# EAGLE design Rotator Control Teensy 26VAC v2 (EAGLE 9.6.2)
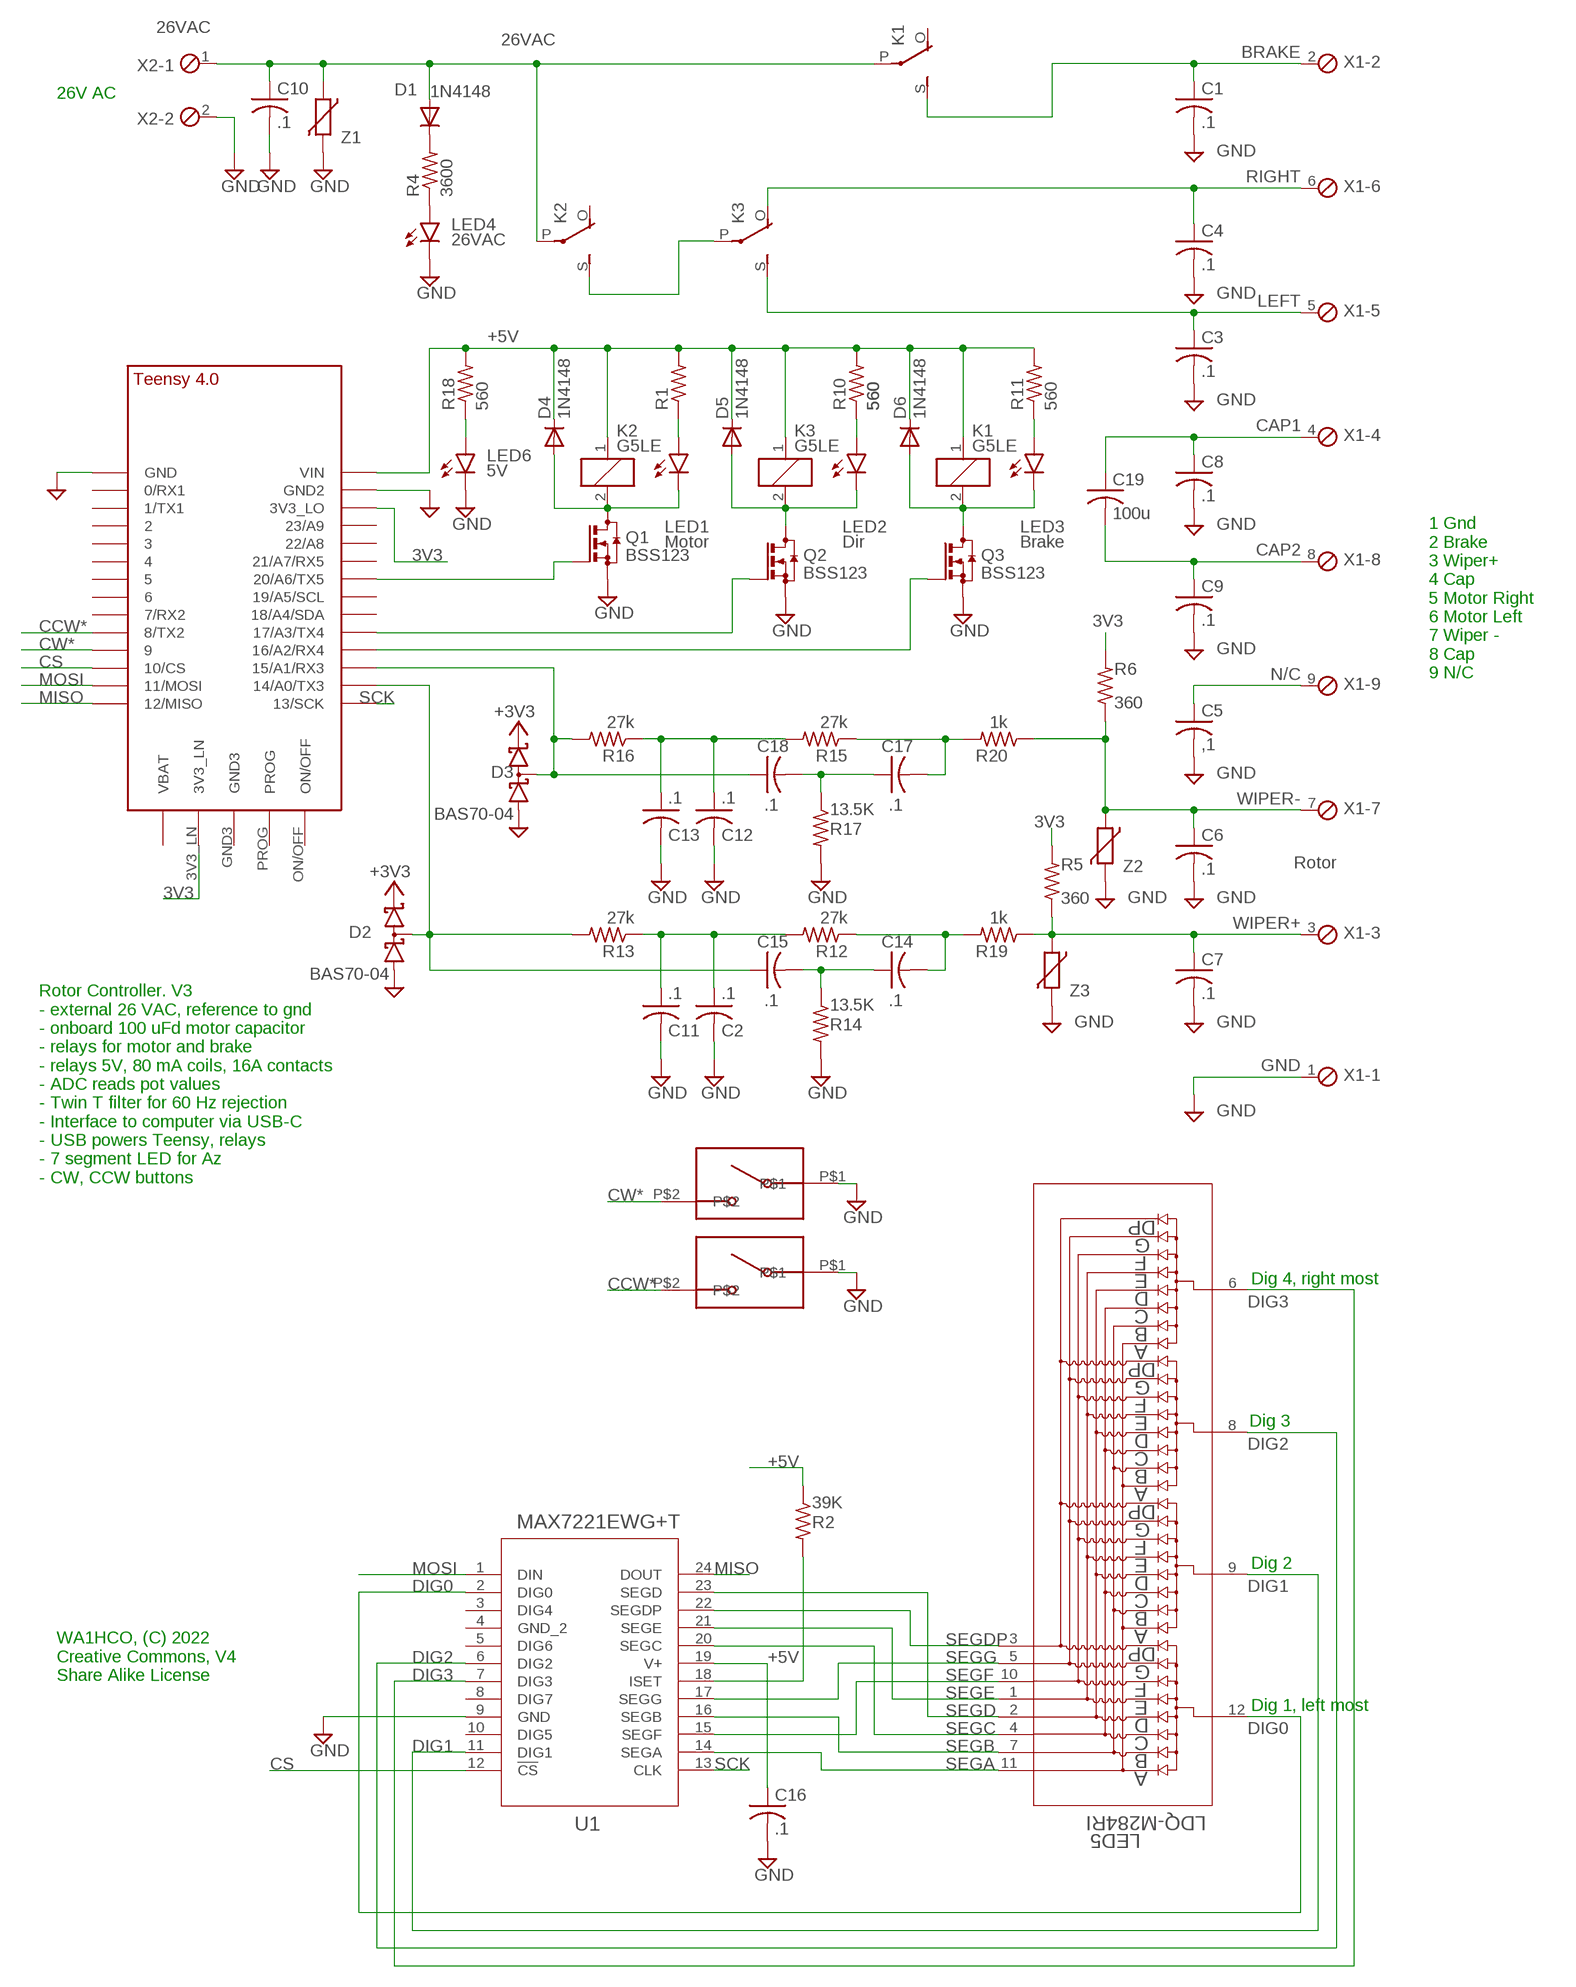
[diagram p0: schematic, sheet 1]

## Parts
C1  .1  C-USC1206  [C1206]
C2  .1  C-USC1206  [C1206]
C3  .1  C-USC1206  [C1206]
C4  .1  C-USC1206  [C1206]
C5  ,1  C-USC1206  [C1206]
C6  .1  C-USC1206  [C1206]
C7  .1  C-USC1206  [C1206]
C8  .1  C-USC1206  [C1206]
C9  .1  C-USC1206  [C1206]
C10  .1  C-USC1206  [C1206]
C11  .1  C-USC1206  [C1206]
C12  .1  C-USC1206  [C1206]
C13  .1  C-USC1206  [C1206]
C14  .1  C-USC1206  [C1206]
C15  .1  C-USC1206  [C1206]
C16  .1  C-USC1206  [C1206]
C17  .1  C-USC1206  [C1206]
C18  .1  C-USC1206  [C1206]
C19  100u  R60EW6100  [C4220]
CCW  SWITCH_AEXIT_6X6X9.5  [PUSHBUTTON_6X6]
CW  SWITCH_AEXIT_6X6X9.5  [PUSHBUTTON_6X6]
D1  1N4148  DIODESOD-123  [SOD-123]
D2  BAS70-04  [SOT23]
D3  BAS70-04  [SOT23]
D4  1N4148  DIODESOD-123  [SOD-123]
D5  1N4148  DIODESOD-123  [SOD-123]
D6  1N4148  DIODESOD-123  [SOD-123]
K1  G5LE  [G5LE]
K2  G5LE  [G5LE]
K3  G5LE  [G5LE]
LED1  Motor  LED3MM  [LED3MM]
LED2  Dir  LED3MM  [LED3MM]
LED3  Brake  LED3MM  [LED3MM]
LED4  26VAC  LED3MM  [LED3MM]
LED5  LDQ-M284RI  [LDQ-M284RI_LUM]
LED6  5V  LED3MM  [LED3MM]
Q1  BSS123  [SOT23]
Q2  BSS123  [SOT23]
Q3  BSS123  [SOT23]
R1  560  R-US_R0805  [R0805]
R2  39K  R-US_R0603  [R0603]
R4  3600  R-US_R0805  [R0805]
R5  360  R-US_R0805  [R0805]
R6  360  R-US_R0805  [R0805]
R10  560  R-US_R0805  [R0805]
R11  560  R-US_R0805  [R0805]
R12  27k  R-US_R0805  [R0805]
R13  27k  R-US_R0805  [R0805]
R14  13.5K  R-US_R0805  [R0805]
R15  27k  R-US_R0805  [R0805]
R16  27k  R-US_R0805  [R0805]
R17  13.5K  R-US_R0805  [R0805]
R18  560  R-US_R0805  [R0805]
R19  1k  R-US_R0805  [R0805]
R20  1k  R-US_R0805  [R0805]
U1  MAX7221EWG+T  [21-0042_W24+1_MXM]
U$1  TEENSY_4.0  [TEENSY_4.0]
X1  Rotor  MPT9  [9POL254]
X2  26VAC  MPT2  [2POL254]
Z1  VARISTORCN1206  [CT/CN1206]
Z2  VARISTORCN1206  [CT/CN1206]
Z3  VARISTORCN1206  [CT/CN1206]

## Nets
3V3: D2.2(C2) D3.2(C2) R5.2 R6.2 U$1.3V3_LN U$1.3V3_LO ; supply symbol labelled +3V3
26VAC: C10.1 D1.A K1.P(2:P) K2.P(2:P) X2.1 Z1.1
+5V: C16.1 D4.C D5.C D6.C K1.1 K2.1 K3.1 R1.2 R2.1 R10.2 R11.2 R18.2 U1.19(V+) U$1.VIN
BRAKE: C1.1 K1.S(2:S) X1.2
CAP1: C8.1 C19.P$1 X1.4
CAP2: C9.1 C19.P$2 X1.8
CCW*: CCW.P$2 U$1.8(8/TX2)
CS: U1.12(!CS) U$1.10/CS
CW*: CW.P$2 U$1.9/CS
DIG0: LED5.12 U1.2(DIG0)
DIG1: LED5.9 U1.11(DIG1)
DIG2: LED5.8 U1.6(DIG2)
DIG3: LED5.6 U1.7(DIG3)
GND: C1.2 C2.2 C3.2 C4.2 C5.2 C6.2 C7.2 C8.2 C9.2 C10.2 C11.2 C12.2 C13.2 C16.2 CCW.P$1 CW.P$1 D2.1(A1) D3.1(A1) LED4.K(C) LED6.K(C) Q1.2(S) Q2.2(S) Q3.2(S) R14.2 R17.2 U1.9(GND) U$1.GND U$1.GND2 X1.1 X2.2 Z1.2 Z2.2 Z3.2
ISET: R2.2 U1.18(ISET)
LEFT: C4.1 K3.O(2:O) X1.6
MISO: U1.24(DOUT) U$1.12/MISO
MOSI: U1.1(DIN) U$1.11/MOSI
N$1: C17.2 R15.1 R20.2
N$2: LED6.A R18.1
N$3: C14.2 R12.1 R19.2
N$4: LED1.A R1.1
N$5: LED2.A R10.1
N$6: LED3.A R11.1
N$7: C15.1 D2.3(C1A2) R13.2 U$1.14/A0(14/A0/TX3)
N$8: K2.S(2:S) K3.P(2:P)
N$9: D4.A K2.2 LED1.K(C) Q1.3(D)
N$10: D5.A K3.2 LED2.K(C) Q2.3(D)
N$11: D6.A K1.2 LED3.K(C) Q3.3(D)
N$12: Q3.1(G) U$1.16/A2(16/A2/RX4)
N$13: Q1.1(G) U$1.20/A6(20/A6/TX5)
N$14: Q2.1(G) U$1.17/A3(17/A3/TX4)
N$17: C2.1 C11.1 R12.2 R13.1
N$18: C14.1 C15.2 R14.1
N$21: C12.1 C13.1 R15.2 R16.1
N$22: C17.1 C18.2 R17.1
N$23: C18.1 D3.3(C1A2) R16.2 U$1.15/A1(15/A1/RX3)
N$24: D1.C R4.2
N$25: LED4.A R4.1
N/C: C5.1 X1.9
RIGHT: C3.1 K3.S(2:S) X1.5
SCK: U1.13(CLK) U$1.13/SCK
SEGA: LED5.11 U1.14(SEGA)
SEGB: LED5.7 U1.16(SEGB)
SEGC: LED5.4 U1.20(SEGC)
SEGD: LED5.2 U1.23(SEGD)
SEGDP: LED5.3 U1.22(SEGDP)
SEGE: LED5.1 U1.21(SEGE)
SEGF: LED5.10 U1.15(SEGF)
SEGG: LED5.5 U1.17(SEGG)
WIPER+: C7.1 R5.1 R19.1 X1.3 Z3.1
WIPER-: C6.1 R6.1 R20.1 X1.7 Z2.1
Unconnected: K1.O(2:O) K2.O(2:O) U1.3(DIG4) U1.4(GND_2) U1.5(DIG6) U1.8(DIG7) U1.10(DIG5) U$1.0/RX(0/RX1) U$1.1/TX(1/TX1) U$1.2 U$1.3/CANTX U$1.4/CANRX U$1.5 U$1.6 U$1.7(7/RX2) U$1.18/A4/SDA U$1.19/A5/SCL U$1.21/A7(21/A7/RX5) U$1.22/A8 U$1.23/A9 U$1.GND3 U$1.ON/OFF U$1.PROG U$1.VBAT\(VBAT)

## Notes on the sheet
- 26V AC
- 1 Gnd
  2 Brake
  3 Wiper+
  4 Cap
  5 Motor Right
  6 Motor Left
  7 Wiper -
  8 Cap
  9 N/C
- Rotor Controller. V3
  - external 26 VAC, reference to gnd
  - onboard 100 uFd motor capacitor
  - relays for motor and brake
  - relays 5V, 80 mA coils, 16A contacts
  - ADC reads pot values
  - Twin T filter for 60 Hz rejection
  - Interface to computer via USB-C
  - USB powers Teensy, relays
  - 7 segment LED for Az
  - CW, CCW buttons
- Dig 4, right most
- Dig 3
- Dig 2
- WA1HCO, (C) 2022
  Creative Commons, V4
  Share Alike License
- Dig 1, left most

## Library data of the parts
C1-C18 = rcl:C-US: CAPACITOR, American symbol; SPICEPREFIX: C
C19 = my-library:R60EW6100
CCW CW = my-library:SWITCH_AEXIT_6X6X9.5
D1 D4-D6 = adafruit:DIODE: Diode SMADIODE - SMA Surface Mount Package 20V 1A Schottky Diode Digikey: 641-1014-6-ND DO-1N4148 - Through Hole Small Current Diode SOD-123 20V 1 A (.5mV Vf) Schottky Diode - Digikey: MBRX120TPMSCT-ND SOD-323 10V 570mA (.38mV Vf, 3ns) Schottky Diode - Digikey: ZLLS410CT-ND SOD-523 30V 30mA Schottky Diode (RB751S-40TE61) - Digikey: RB751S-40TE61CT-ND SOT23-R/W - SOT23 Package (R = Solder Paste/Reflow Ovens, W = Hand-Soldering) BAT54Film 40V 300mA - Digikey: 497-7162-1-ND
D2 D3 = diode:BAS70-04: Silicon Schottky Diodes General-purpose diode for high-speed switching
K1-K3 = relay:G5LE: RELAY 1 x switch, 10 A/120 V AC, 8 A/30 V DC, Omron; OC_FARNELL: unknown; OC_NEWARK: unknown
LED1-LED4 LED6 = led:LED: LED OSRAM: - CHIPLED LG R971, LG N971, LY N971, LG Q971, LY Q971, LO R971, LY R971 LH N974, LH R974 LS Q976, LO Q976, LY Q976 LO Q996 - Hyper CHIPLED LW Q18S LB Q993, LB Q99A, LB R99A - SideLED LS A670, LO A670, LY A670, LG A670, LP A670 LB A673, LV A673, LT A673, LW A673 LH A674 LY A675 LS A676, LA A676, LO A676, LY A676, LW A676 LS A679, LY A679, LG A679 - Hyper Micro SIDELED® LS Y876, LA Y876, LO Y876, LY Y876 LT Y87S - SmartLED LW L88C, LW L88S LB L89C, LB L89S, LG L890 LS L89K, LO L89K, LY L89K LS L896, LA L896, LO L896, LY L896 - TOPLED LS T670, LO T670, LY T670, LG T670, LP T670 LSG T670, LSP T670, LSY T670, LOP T670, LYG T670 LG T671, LOG T671, LSG T671 LB T673, LV T673, LT T673, LW T673 LH T674 LS T676, LA T676, LO T676, LY T676, LB T676, LH T676, LSB T676, LW T676 LB T67C, LV T67C, LT T67C, LS T67K, LO T67K, LY T67K, LW E67C LS E67B, LA E67B, LO E67B, LY E67B, LB E67C, LV E67C, LT E67C LW T67C LS T679, LY T679, LG T679 LS T770, LO T770, LY T770, LG T770, LP T770 LB T773, LV T773, LT T773, LW T773 LH T774 LS E675, LA E675, LY E675, LS T675 LS T776, LA T776, LO T776, LY T776, LB T776 LHGB T686 LT T68C, LB T68C - Hyper Mini TOPLED® LB M676 - Mini TOPLED Santana® LG M470 LS M47K, LO M47K, LY M47K Source: http://www.osram.convergy.de LUXEON: - LUMILED® LXK2-PW12-R00, LXK2-PW12-S00, LXK2-PW14-U00, LXK2-PW14-V00 LXK2-PM12-R00, LXK2-PM12-S00, LXK2-PM14-U00 LXK2-PE12-Q00, LXK2-PE12-R00, LXK2-PE12-S00, LXK2-PE14-T00, LXK2-PE14-U00 LXK2-PB12-K00, LXK2-PB12-L00, LXK2-PB12-M00, LXK2-PB14-N00, LXK2-PB14-P00, LXK2-PB14-Q00 LXK2-PR12-L00, LXK2-PR12-M00, LXK2-PR14-Q00, LXK2-PR14-R00 LXK2-PD12-Q00, LXK2-PD12-R00, LXK2-PD12-S00 LXK2-PH12-R00, LXK2-PH12-S00 LXK2-PL12-P00, LXK2-PL12-Q00, LXK2-PL12-R00 Source: www.luxeon.com KINGBRIGHT: KA-3528ASYC Source: www.kingbright.com
LED5 = my-library:LDQ-M284RI; COPYRIGHT: Copyright (C) 2022 Ultra Librarian. All rights reserved.; DIGI-KEY_PART_NUMBER_1: 67-1427-ND; MANUFACTURER_PART_NUMBER: LDQ-M284RI; MFR_NAME: Lumex
Q1-Q3 = transistor-small-signal:BSS123: N-CHANNEL MOS FET
R1 R2 R4-R6 R10-R20 = rcl:R-US_: RESISTOR, American symbol; SPICEPREFIX: R
U1 = MAX7219:MAX7221EWG+T; COPYRIGHT: Copyright (C) 2022 Ultra Librarian. All rights reserved.; DIGI-KEY_PART_NUMBER_1: MAX7219EWG+T-ND; DIGI-KEY_PART_NUMBER_2: MAX7219EWG+TCT-ND; DIGI-KEY_PART_NUMBER_3: MAX7219EWG+TDKR-ND; DIGI-KEY_PART_NUMBER_4: MAX7219EWG+TTR-ND; MANUFACTURER_PART_NUMBER: MAX7219EWG+T; MFR_NAME: Maxim Integrated Products
U$1 = TEENSY 4.0:TEENSY_4.0
X1 = con-phoenix-254:MPT9: PHOENIX CONNECTOR; OC_FARNELL: unknown; OC_NEWARK: unknown
X2 = con-phoenix-254:MPT2: PHOENIX CONNECTOR; OC_FARNELL: unknown; OC_NEWARK: unknown
Z1-Z3 = varistor:VARISTOR: VARISTOR

## Board
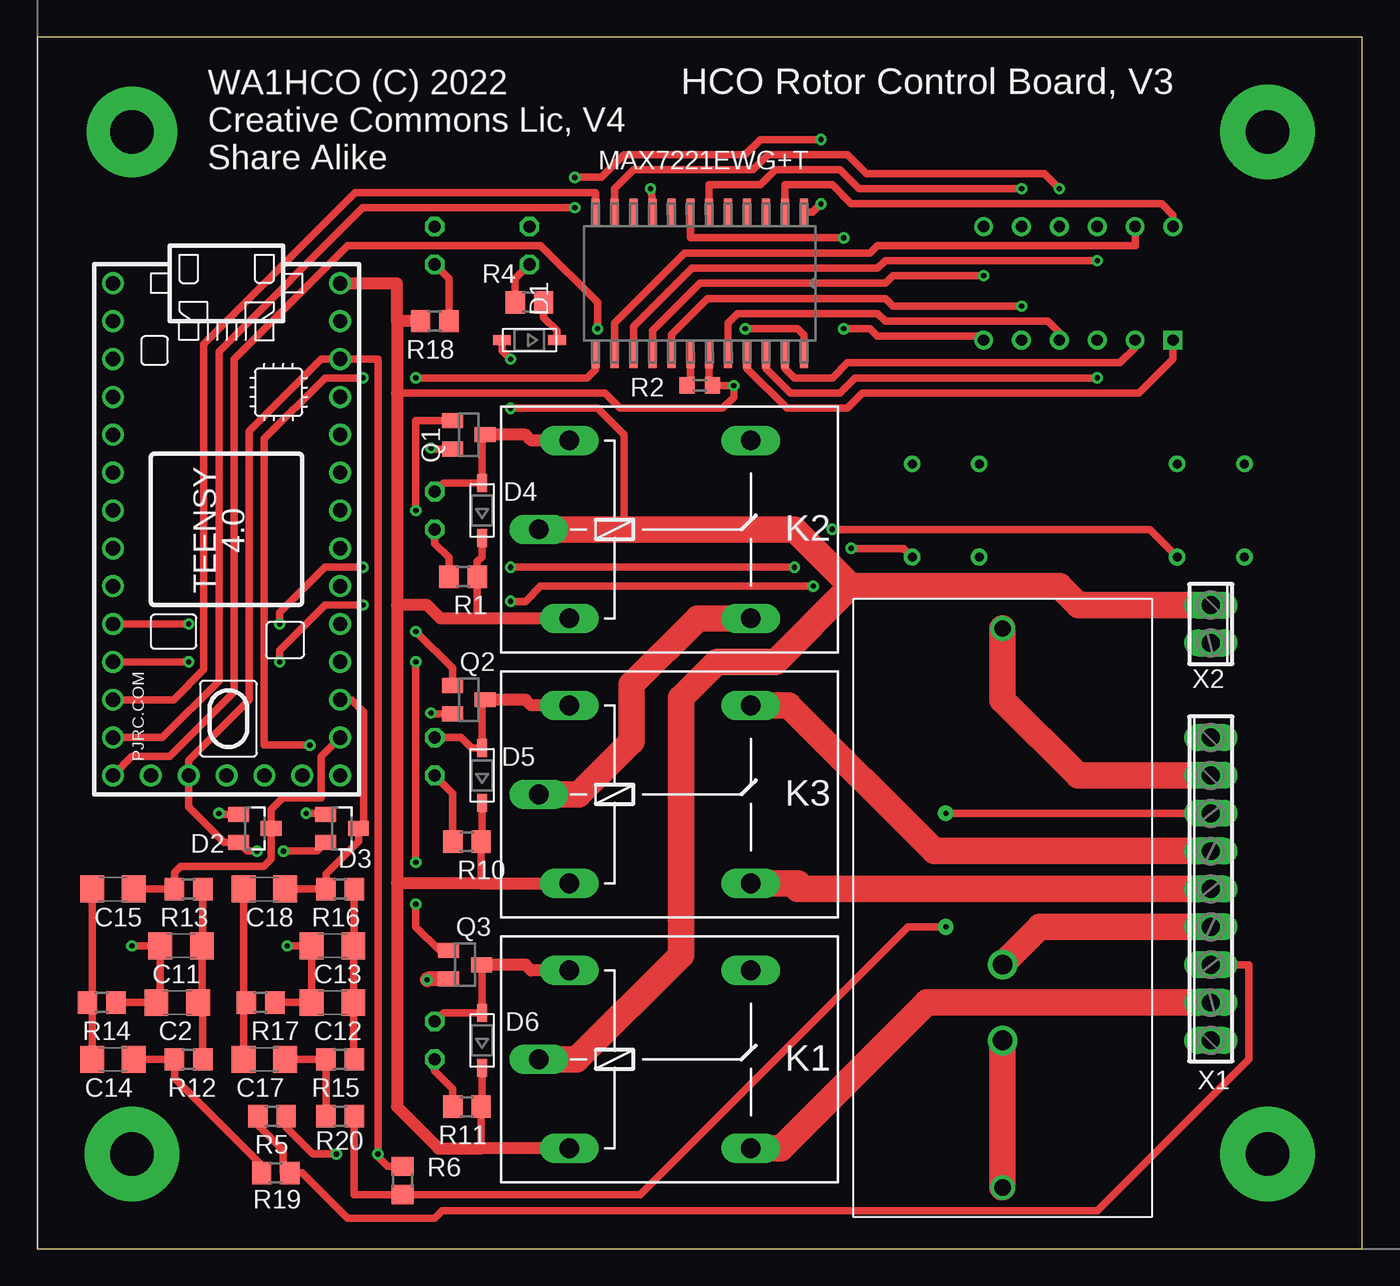
[diagram p1: board, top side]
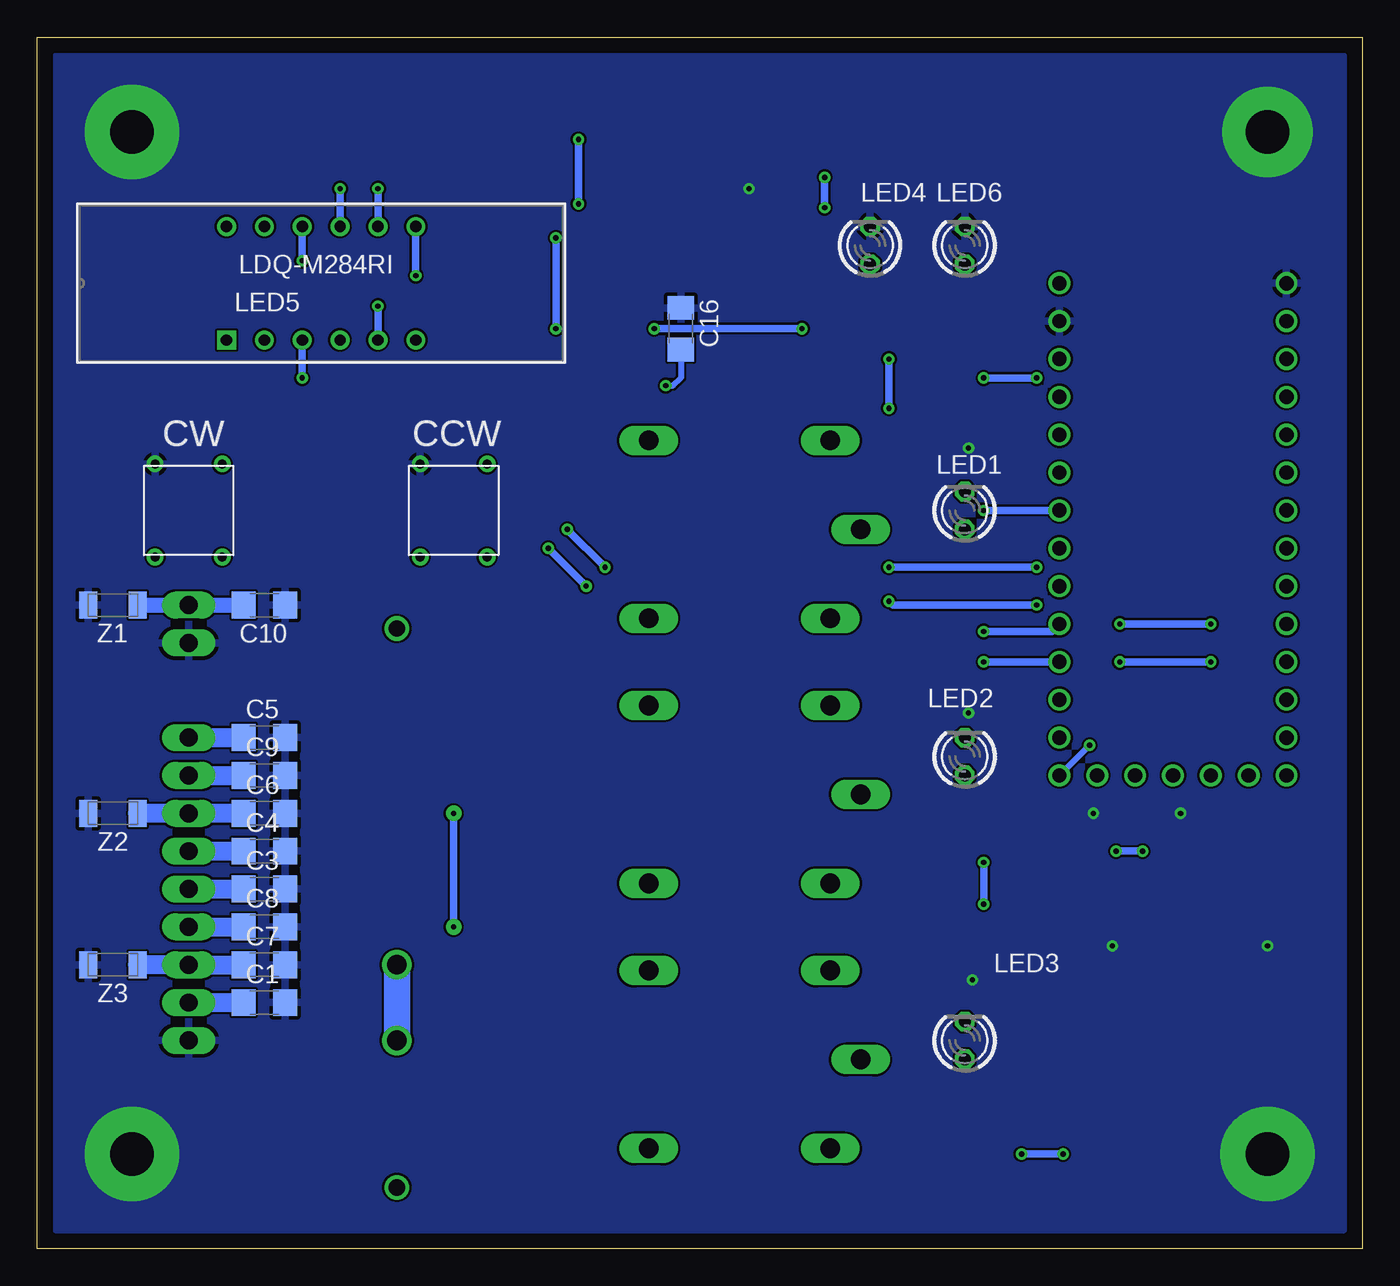
[diagram p2: board, bottom side, seen from below]

Size 88.9 x 81.28 mm. Coordinates in mm from the lower left corner, seen from the top.
Outline: 0,0 88.9,0 88.9,81.28 0,81.28 0,0
Copper layers (1*16): Top 0.035mm / dielectric 1.5mm / Bottom 0.035mm
Design rules "default": minimum track width 6mil, minimum drill 0.35mm, track to track 6mil, track to pad 6mil, pad to pad 6mil, via to via 6mil, smd to smd 6mil, copper to edge 40mil, drill to drill 6mil, minimum pad ring 10mil, minimum via ring 8mil, stop-mask expansion 4mil, vias tented up to drill 0mil, thermal gap 10mil

### Footprints (pad centres in the part's own frame; a part is rotated, then mirrored left to right if it is on the bottom)
C1206 = smd 1.6 x 1.8: 1 -1.4,0; 2 1.4,0
C4220 = drill 1.1: P$1 -18.75,0; P$2 18.75,0
PUSHBUTTON_6X6 = drill 0.6: P$1 -2.25,3.125; P$2 2.25,-3.125; P$3 -2.25,-3.125; P$4 2.25,3.125
SOD-123 = smd 1.2 x 0.7: A 1.85,0; C -1.85,0
SOT23 = smd 1 x 1.4: 1 -0.95,-1.1; 2 0.95,-1.1; 3 0,1.1
G5LE = drill 1.321 long: 1 -7.493,-5.969; 2 -7.493,5.969; O 4.699,5.969; P -9.525,0; S 4.699,-5.969
LED3MM = drill 0.813 octagon: A -1.27,0; K 1.27,0
LDQ-M284RI_LUM = drill 0.762 pad 1.27 square: 1 0,0 | drill 0.762 pad 1.27: 2 0,-2.54; 3 0,-5.08; 4 0,-7.62; 5 0,-10.16; 6 0,-12.7; 7 7.62,-12.7; 8 7.62,-10.16; 9 7.62,-7.62; 10 7.62,-5.08; 11 7.62,-2.54; 12 7.62,0
R0805 = smd 1.3 x 1.5: 1 -0.95,0; 2 0.95,0
R0603 = smd 1 x 1.1: 1 -0.85,0; 2 0.85,0
21-0042_W24+1_MXM = smd 1.845 x 0.533: 1 -4.758,6.985; 2 -4.758,5.715; 3 -4.758,4.445; 4 -4.758,3.175; 5 -4.758,1.905; 6 -4.758,0.635; 7 -4.758,-0.635; 8 -4.758,-1.905; 9 -4.758,-3.175; 10 -4.758,-4.445; 11 -4.758,-5.715; 12 -4.758,-6.985; 13 4.758,-6.985; 14 4.758,-5.715; 15 4.758,-4.445; 16 4.758,-3.175; 17 4.758,-1.905; 18 4.758,-0.635; 19 4.758,0.635; 20 4.758,1.905; 21 4.758,3.175; 22 4.758,4.445; 23 4.758,5.715; 24 4.758,6.985
TEENSY_4.0 = drill 0.965: 0/RX -13.97,-7.62; 1/TX -11.43,-7.62; 2 -8.89,-7.62; 3/CANTX -6.35,-7.62; 3V3_LN 16.51,-2.54; 3V3_LO -11.43,7.62; 4/CANRX -3.81,-7.62; 5 -1.27,-7.62; 6 1.27,-7.62; 7 3.81,-7.62; 8 6.35,-7.62; 9/CS 8.89,-7.62; 10/CS 11.43,-7.62; 11/MOSI 13.97,-7.62; 12/MISO 16.51,-7.62; 13/SCK 16.51,7.62; 14/A0 13.97,7.62; 15/A1 11.43,7.62; 16/A2 8.89,7.62; 17/A3 6.35,7.62; 18/A4/SDA 3.81,7.62; 19/A5/SCL 1.27,7.62; 20/A6 -1.27,7.62; 21/A7 -3.81,7.62; 22/A8 -6.35,7.62; 23/A9 -8.89,7.62; GND -16.51,-7.62; GND2 -13.97,7.62; GND3 16.51,0; ON/OFF 16.51,5.08; PROG 16.51,2.54; VBAT\ 16.51,-5.08; VIN -16.51,7.62
9POL254 = drill 1.2 long: 1 -10.16,0; 2 -7.62,0; 3 -5.08,0; 4 -2.54,0; 5 0,0; 6 2.54,0; 7 5.08,0; 8 7.62,0; 9 10.16,0
2POL254 = drill 1.2 long: 1 -1.27,0; 2 1.27,0
CT/CN1206 = smd 1.2 x 1.8: 1 -1.65,0; 2 1.65,0

### Placement (x,y rotation side)
C1  73.66,16.51 0 bottom
C2  9.4,16.51 180 top
C3  73.66,24.13 0 bottom
C4  73.66,26.67 0 bottom
C5  73.66,34.29 0 bottom
C6  73.66,29.21 0 bottom
C7  73.66,19.05 0 bottom
C8  73.66,21.59 0 bottom
C9  73.66,31.75 0 bottom
C10  73.66,43.18 0 bottom
C11  9.65,20.32 180 top
C12  19.81,16.51 180 top
C13  19.81,20.32 180 top
C14  5.08,12.7 0 top
C15  5.08,24.13 180 top
C16  45.72,61.72 90 bottom
C17  15.24,12.7 0 top
C18  15.24,24.13 180 top
C19  64.77,22.86 90 top
CCW  78.74,49.53 0 bottom
CW  60.96,49.53 0 bottom
D1  33.02,60.96 180 top
D2  14.61,28.19 270 top
D3  20.45,28.19 270 top
D4  29.84,49.53 90 top
D5  29.84,31.75 90 top
D6  29.84,13.97 90 top
K1  43.18,12.7 0 top
K2  43.18,48.26 0 top
K3  43.18,30.48 0 top
LED1  26.67,49.53 90 bottom
LED2  26.67,33.02 90 bottom
LED3  26.67,13.97 90 bottom
LED4  33.02,67.31 90 bottom
LED5  76.2,60.96 90 bottom
LED6  26.67,67.31 90 bottom
Q1  28.96,54.61 270 top
Q2  28.96,36.83 270 top
Q3  28.7,19.05 270 top
R1  28.57,45.09 0 top
R2  44.45,57.91 180 top
R4  33.02,63.5 0 top
R5  15.75,8.89 0 top
R6  24.51,4.57 90 top
R10  28.83,27.3 0 top
R11  28.83,9.53 0 top
R12  10.16,12.7 0 top
R13  10.16,24.13 180 top
R14  4.32,16.51 0 top
R15  20.32,12.7 0 top
R16  20.32,24.13 180 top
R17  14.99,16.51 0 top
R18  26.67,62.23 180 top
R19  16,5.08 180 top
R20  20.32,8.89 180 top
U1  44.45,64.77 270 top
U$1  12.7,48.26 270 top
X1  78.74,24.13 90 top
X2  78.74,41.91 270 top
Z1  83.82,43.18 180 bottom
Z2  83.82,29.21 180 bottom
Z3  83.82,19.05 180 bottom

### Tracks (layer width: path | path; a pad name or v marks a point on that pad's centre or on a via)
3V3  (via drill 0.35)
  Top 0.508: R6.2 23.5,5.52 22.86,6.16 v22.86,6.35 22.86,59.69 U$1.3V3_LO 19.05,59.69 14.22,54.86 14.22,36.83 10.16,32.77 U$1.3V3_LN 10.16,29.62 12.54,27.24 D2.2 14.08,26.67 v14.73,26.67 | R5.2 16.7,8.13 18.48,6.35 v20.07,6.35 | D3.2 18.77,26.67 v16.51,26.67
  Bottom 0.508: v22.86,6.35 v20.07,6.35 | v16.51,26.67 v14.73,26.67
26VAC  (via drill 0.35)
  Top 0.508: 39.37,48.26 39.37,54.61 37.59,56.39 34.98,56.39 v31.75,56.39 | D1.A 31.17,60.27 v31.75,59.69
  Top 1.778: K1.P 36.2,12.7 43.18,19.68 43.18,36.96 45.59,39.37 49.53,39.37 54.61,44.45 | 54.61,44.45 50.8,48.26 39.37,48.26 K2.P | X2.1 69.85,43.18 68.58,44.45 54.61,44.45
  Bottom 0.508: v31.75,59.69 v31.75,56.39
  Bottom 1.016: C10.1 X2.1 Z1.1
+5V  (via drill 0.35)
  Top 0.508: 29.52,42.29 R1.2 29.52,46.09 29.84,46.41 D4.C | 29.78,6.73 R11.2 29.84,9.53 D6.C | D5.C 29.84,27.37 R10.2 29.78,24.51 | U1.19 45.09,57.91 R2.1 v46.74,57.91 46.74,57.15 45.97,56.39 39.12,56.39 38.1,57.4 24.13,57.4
  Top 0.813: K2.1 29.52,42.29 27.05,42.29 26.16,43.18 24.13,43.18 | K1.1 29.78,6.73 26.92,6.73 24.13,9.53 24.13,24.51 | U$1.VIN 24.13,64.77 24.13,62.23 | R18.2 24.13,62.23 | 24.13,62.23 24.13,57.4 24.13,43.18 | 24.13,43.18 24.13,24.51 | 24.13,24.51 29.78,24.51 K3.1
  Bottom 0.406: C16.1 45.72,58.42 46.23,57.91 v46.74,57.91
BRAKE
  Top 1.778: X1.2 59.69,16.51 49.91,6.73 K1.S
  Bottom 1.27: X1.2 C1.1
CAP1  (via drill 1.32)
  Top 1.778: X1.4 67.28,21.59 64.77,19.07 v64.77,19.05 | C19.P$1 v64.77,13.97
  Bottom 1.27: X1.4 C8.1
  Bottom 1.778: v64.77,19.05 v64.77,13.97
CAP2
  Top 1.778: X1.8 69.85,31.75 64.77,36.83 C19.P$2
  Bottom 1.27: X1.8 C9.1
CCW*  (via drill 0.35)
  Top 0.508: CCW.P$2 74.64,48.26 v53.34,48.26 | v50.8,45.72 v31.75,45.72 | v16.26,41.91 16.26,42.67 19.3,45.72 v21.84,45.72 | U$1.8 v10.16,41.91
  Bottom 0.508: v53.34,48.26 v50.8,45.72 | v31.75,45.72 v21.84,45.72 | v10.16,41.91 v16.26,41.91
CS
  Top 0.508: U1.12 37.47,70.87 21.34,70.87 11.18,60.71 11.18,38.86 9.14,36.83 U$1.10/CS
CW*  (via drill 0.35)
  Top 0.508: CW.P$2 58.12,46.99 v54.61,46.99 | v52.07,44.45 33.78,44.45 32.77,43.43 v31.75,43.43 | v16.26,39.37 16.26,40.13 19.3,43.18 v21.84,43.18 | U$1.9/CS v10.16,39.37
  Bottom 0.508: v54.61,46.99 v52.07,44.45 | v31.75,43.43 31.5,43.18 v21.84,43.18 | v10.16,39.37 v16.26,39.37
DIG0
  Top 0.508: U1.2 50.16,71.37 53.34,71.37 54.61,70.1 75.44,70.1 76.2,69.34 LED5.12
DIG1  (via drill 0.35)
  Top 0.508: U1.11 38.73,71.12 40.01,72.39 48.01,72.39 49.02,73.41 54.36,73.41 55.63,72.14 67.56,72.14 v68.58,71.12
  Bottom 0.508: v68.58,71.12 LED5.9
DIG2  (via drill 0.35)
  Top 0.508: U1.6 45.09,71.37 48.51,71.37 49.53,72.39 53.85,72.39 55.12,71.12 v66.04,71.12
  Bottom 0.508: v66.04,71.12 LED5.8
DIG3  (via drill 0.35)
  Top 0.508: U1.7 43.81,67.82 v54.1,67.82 | LED5.6 63.25,61.21 56.39,61.21 55.88,61.72 v54.1,61.72
  Bottom 0.508: v54.1,67.82 v54.1,61.72
GND  (via drill 0.35, 2.92 pad 6.1, 2.92 pad 6.35)
  Top 0.406: 41.23,71.04 v41.15,71.12
  Top 0.508: Q1.2 26.48,53.66 v26.42,53.72 | Q2.2 26.42,35.88 v26.42,35.94 | v6.35,20.32 C11.2 8.25,16.51 C2.2 R14.2 | v16.76,20.32 C13.2 C12.2 R17.2 | 41.23,71.04 U1.9 | D2.1 12.26,29.14 v12.19,29.21 | D3.1 19.28,29.21 v18.03,29.21
  Top 1.016: Q3.2 26.23,18.1 v26.16,18.03
  other vias: 6.35,6.35 82.55,6.35 82.55,74.93 6.35,74.93
  pour Bottom: 1.27,80.01 87.63,80.01 87.63,1.27 1.27,1.27
ISET
  Top 0.406: 43.81,58.13 R2.2
  Top 0.508: U1.18 43.81,58.13
LEFT
  Top 1.778: K3.O 50.42,36.45 60.2,26.67 61.21,26.67 X1.6
  Bottom 1.27: X1.6 C4.1
MISO  (via drill 0.35)
  Top 0.508: v37.59,61.72 37.59,63.5 33.78,67.31 20.83,67.31 13.21,59.69 13.21,37.34 8.89,33.02 6.35,33.02 U$1.12/MISO | U1.24 51.44,61.28 50.99,61.72 v47.5,61.72
  Bottom 0.508: v47.5,61.72 44.45,61.72 v37.59,61.72
MOSI  (via drill 0.35)
  Top 0.508: v36.07,71.88 37.85,71.88 39.37,73.41 47.5,73.41 48.51,74.42 v52.58,74.42 | v36.07,69.85 21.84,69.85 12.19,60.2 12.19,38.1 8.38,34.29 U$1.11/MOSI | v52.58,70.1 52,69.53 U1.1
  Bottom 0.508: v52.58,74.42 v52.58,70.1 | v36.07,71.88 v36.07,69.85
N$1
  Top 0.508: C17.2 R15.1 R20.2
N$2
  Top 0.508: R18.1 27.62,65.09 LED6.A
N$3
  Top 0.508: C14.2 R12.1 9.21,11.43 15.05,5.59 R19.2
N$4
  Top 0.508: R1.1 27.62,46.35 26.67,47.31 LED1.A
N$5
  Top 0.508: LED2.A 27.88,30.54 R10.1
N$6
  Top 0.508: R11.1 27.88,10.73 26.67,11.94 LED3.A
N$7
  Top 0.508: U$1.14/A0 19.05,33.02 19.05,30.23 16.47,30.23 15.71,29.46 D2.3 15.71,26.16 15.2,25.65 9.61,25.65 9.21,25.25 R13.2 C15.1
N$8
  Top 1.778: K2.S 44.32,42.29 39.88,37.85 39.88,34.04 36.32,30.48 K3.P
N$9
  Top 0.508: Q1.3 29.97,54.61 29.84,54.49 D4.A 27.25,51.38 LED1.K
  Top 0.813: K2.2 33.15,54.23 32.77,54.61 Q1.3
N$10
  Top 0.508: Q2.3 29.84,36.62 D5.A 29.14,33.6 28.45,34.29 LED2.K
  Top 0.813: K3.2 33.15,36.45 32.77,36.83 Q2.3
N$11
  Top 0.508: Q3.3 29.84,19.01 D6.A 27.25,15.82 LED3.K
  Top 0.813: K1.2 33.15,18.67 32.77,19.05 Q3.3
N$12  (via drill 0.35)
  Top 0.508: Q3.1 26.99,20 25.4,21.59 v25.4,23.11 | v25.4,39.37 v25.4,25.91
  Bottom 0.508: U$1.16/A2 v25.4,39.37 | v25.4,25.91 v25.4,23.11
N$13  (via drill 0.35)
  Top 0.508: Q1.1 25.4,55.56 v25.4,49.53
  Bottom 0.508: U$1.20/A6 v25.4,49.53
N$14  (via drill 0.35)
  Top 0.508: Q2.1 27.86,38.95 v25.4,41.4
  Bottom 0.508: v25.4,41.4 20.83,41.4 U$1.17/A3
N$17
  Top 0.508: R12.2 11.11,16.2 C2.1 11.05,16.51 C11.1 11.11,20.32 R13.1
N$18
  Top 0.508: C15.2 3.68,16.51 | R14.1 3.68,16.51 | C14.1 3.68,16.51
N$21
  Top 0.508: R16.1 21.27,20.32 C13.1 C12.1 21.21,12.76 R15.2
N$22
  Top 0.508: C17.1 13.84,16.31 R17.1 13.84,16.71 C18.2
N$23
  Top 0.508: C18.1 R16.2 19.37,25.15 21.55,27.32 D3.3 21.91,28.19 | U$1.15/A1 21.08,36.83 21.91,36 21.91,28.19 | 21.91,28.19
N$24
  Top 0.508: R4.2 33.97,62.48 34.87,61.58 D1.C
N$25
  Top 0.508: R4.1 32.07,65.09 LED4.A
N/C
  Bottom 1.27: X1.9 C5.1
RIGHT
  Top 1.778: K3.S 51.05,24.51 51.05,24.13 X1.5
  Bottom 1.27: X1.5 C3.1
SCK  (via drill 0.35)
  Top 0.508: v18.29,33.78 15.24,33.78 15.24,54.36 19.3,58.42 v21.84,58.42 | U1.13 37.47,59 36.89,58.42 v25.4,58.42
  Bottom 0.406: U$1.13/SCK v18.29,33.78
  Bottom 0.508: v21.84,58.42 v25.4,58.42
SEGA
  Top 0.508: U1.14 38.73,62.1 43.43,66.8 55.88,66.8 56.39,67.31 73.66,67.31 LED5.11
SEGB  (via drill 0.35)
  Top 0.508: U1.16 41.27,61.59 44.45,64.77 56.9,64.77 57.4,65.28 v63.5,65.28
  Bottom 0.508: v63.5,65.28 LED5.7
SEGC
  Top 0.508: U1.20 46.35,62.1 46.99,62.74 56.39,62.74 56.9,62.23 67.82,62.23 68.58,61.47 LED5.4
SEGD
  Top 0.508: LED5.2 73.66,60.45 72.64,59.44 54.36,59.44 53.34,58.42 50.8,58.42 50.16,59.05 U1.23
SEGDP  (via drill 0.35)
  Top 0.508: U1.22 48.9,59.05 50.55,57.4 53.85,57.4 54.86,58.42 v71.12,58.42
  Bottom 0.508: v71.12,58.42 LED5.3
SEGE
  Top 0.508: LED5.1 76.2,59.69 73.91,57.4 55.37,57.4 54.36,56.39 50.29,56.39 47.62,59.05 U1.21
SEGF  (via drill 0.35)
  Top 0.508: U1.15 40.01,61.85 43.94,65.79 56.39,65.79 56.9,66.29 v71.12,66.29
  Bottom 0.508: v71.12,66.29 LED5.10
SEGG  (via drill 0.35)
  Top 0.508: U1.17 42.55,61.34 44.96,63.75 56.9,63.75 57.4,63.25 v66.04,63.25
  Bottom 0.508: v66.04,63.25 LED5.5
WIPER+
  Top 0.508: X1.3 81.28,19.05 81.28,12.7 71.12,2.54 27.18,2.54 26.67,2.03 20.83,2.03 17.78,5.08 R19.1 16.51,5.08 16.51,6.6 14.8,8.32 R5.1
  Bottom 1.27: Z3.1 X1.3 C7.1
WIPER-  (via drill 0.35 pad 1.05)
  Top 0.508: X1.7 v60.96,29.21 | v60.96,21.59 58.42,21.59 40.45,3.62 R6.1 21.27,3.62 R20.1
  Bottom 0.508: v60.96,29.21 v60.96,21.59
  Bottom 1.27: C6.1 X1.7 Z2.1

### Text on the board
_tsilk: HCO Rotor Control Board, V3 | WA1HCO (C) 2022 / Creative Commons Lic, V4 / Share Alike
_bsilk: CCW | CW